# Altium schematic sheet LCD.SchDoc
size A3; SheetNumber: 5; SheetTotal: 6
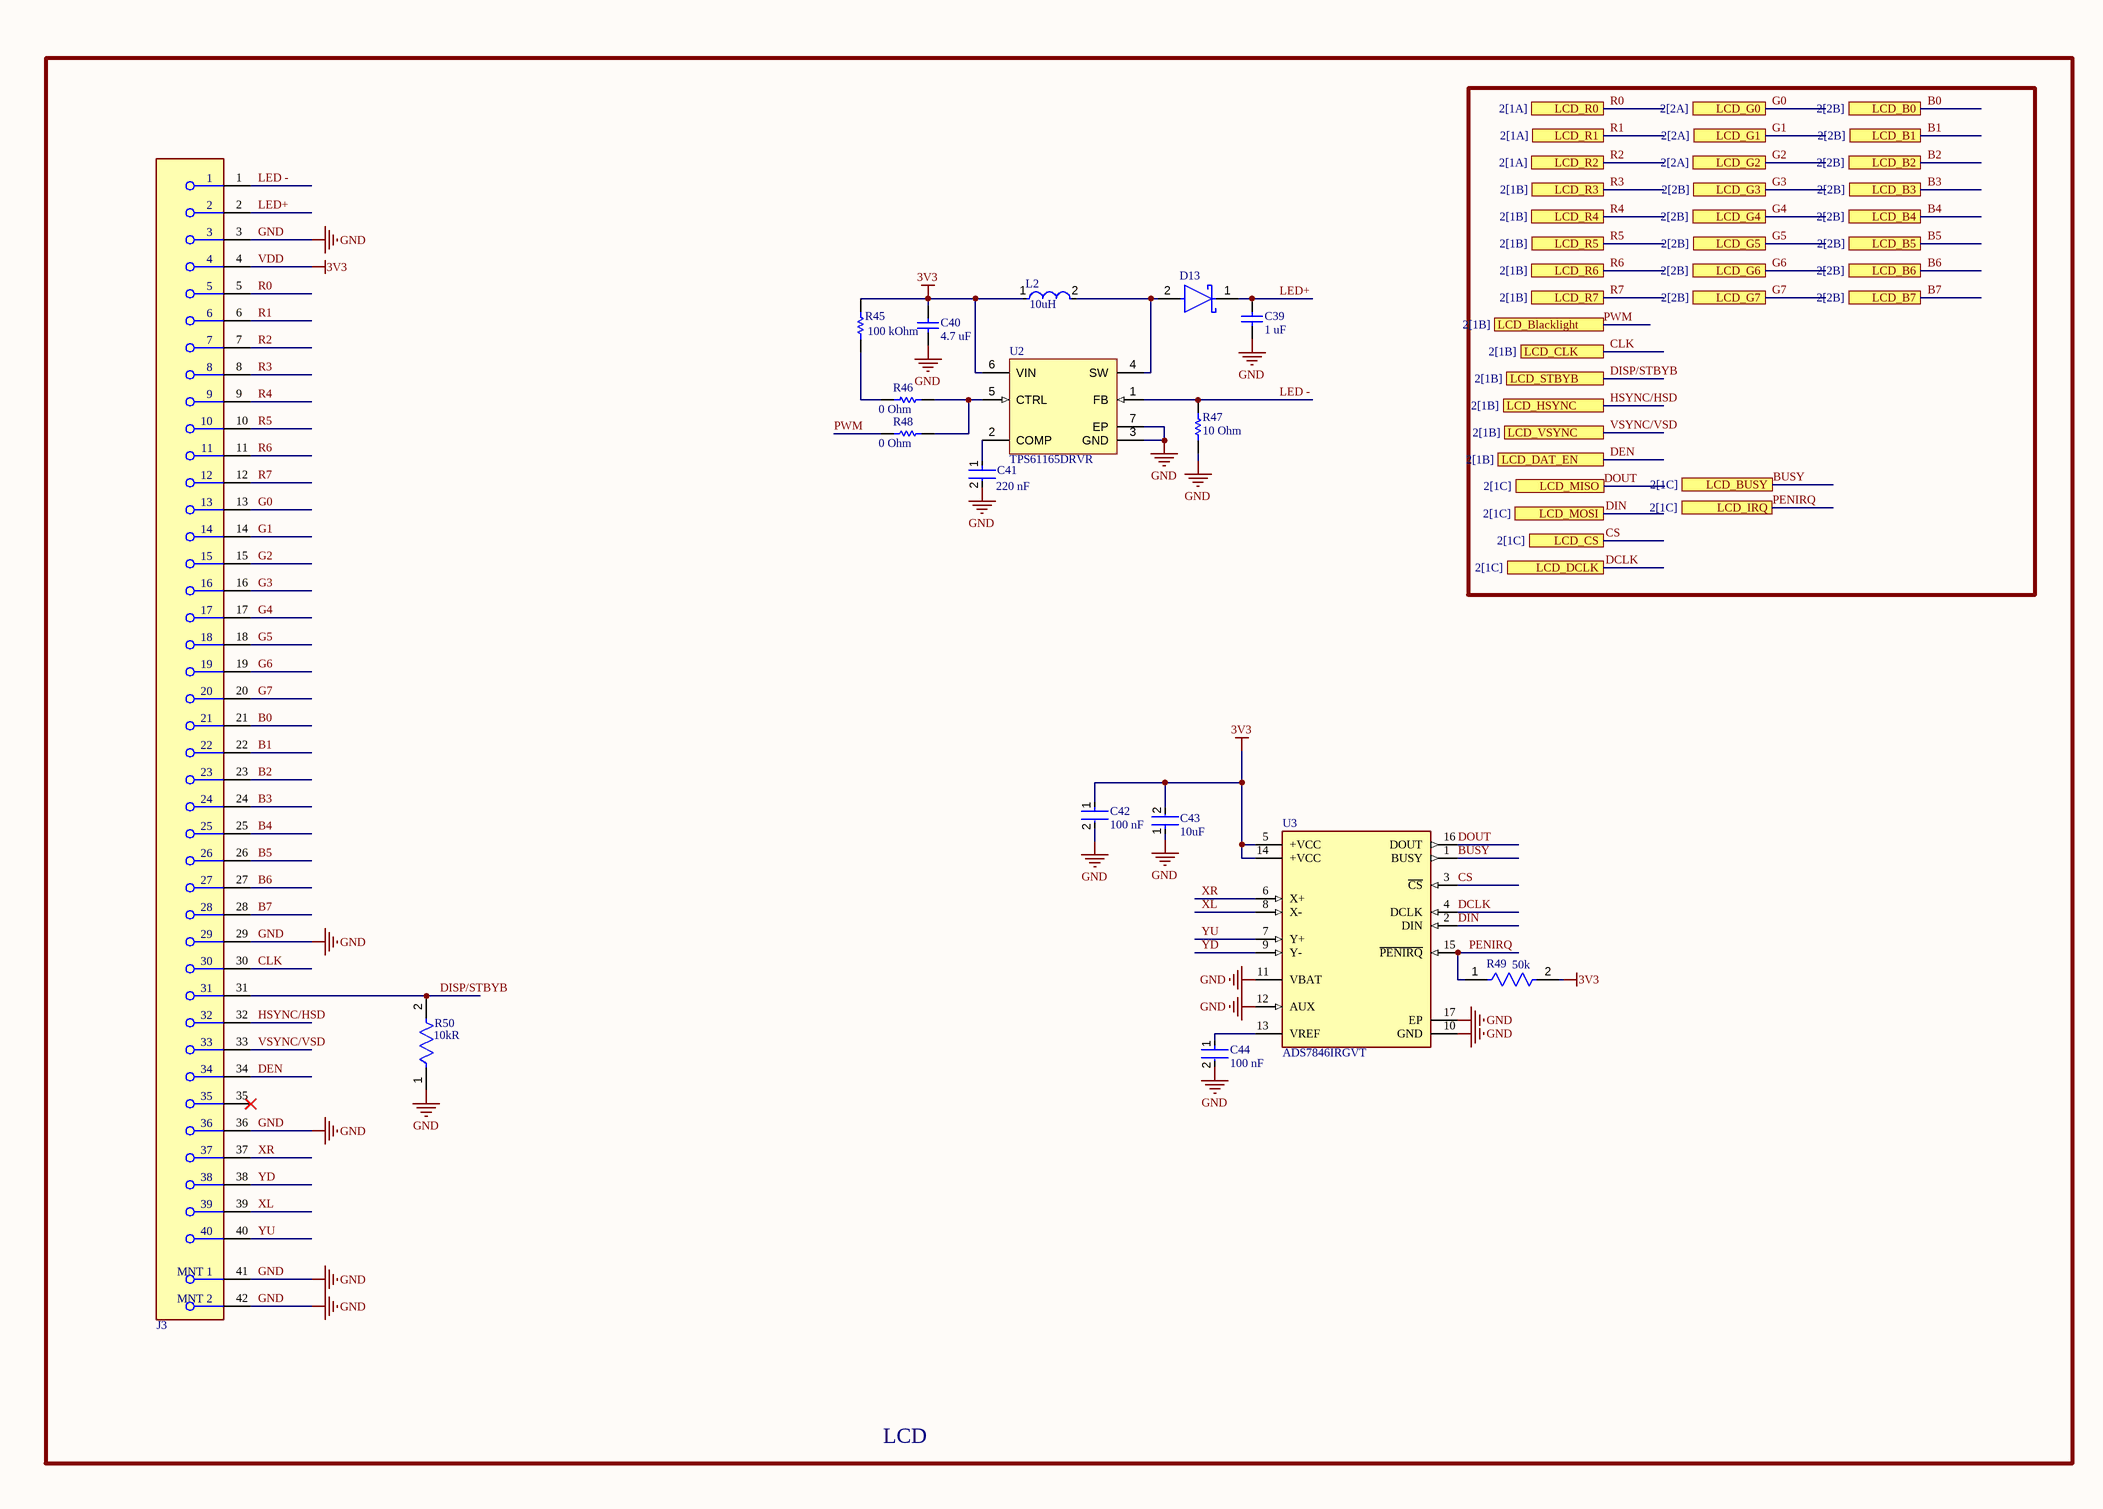
[diagram p0: LCD.SchDoc]

## Parts
C39  value 1 uF  [CAPC2013X135X45LL10T25]  (hidden comment: GRM21BR60J225KA01K)
C40  value 4.7 uF  [CAPC2013X145X50NL20T25]  (hidden comment: C0805C475K9PACTU)
C41  value 220 nF  [FP-CC0805-0_85-MFG]  (hidden comment: CC0805KPX7R7BB224)
C42  value 100 nF  [FP-CC0603-DA-MFG]  (hidden comment: CC0603KRX7R7BB104)
C43  Capacitance: 10uF  [FP-GRM21B-0_15-IPC_A]  (hidden comment: GRM21BR61E106MA73L)
C44  value 100 nF  [FP-CC0603-DA-MFG]  (hidden comment: CC0603KRX7R7BB104)
D13  MBR0540-TP  [FP-SOD-123-MFG]  (value not drawn)
J3  FH12-40S-0.5SH(55)  [FP-FH12-40S-0_5SH_55-MFG]  (value not drawn)
L2  Inductance: 10uH  [FP-NR6012-MFG]  (hidden comment: NR6012T100ME)
R45  value 100 kOhm  [RESC2013X70X40NL20T20]  (hidden comment: ERJ-6GEYJ104V)
R46  value 0 Ohm  [RESC2013X50X30LL20T20]  (hidden comment: CRCW08050000Z0EA)
R47  value 10 Ohm  [RESC2013X50X30NL20T20]  (hidden comment: CRCW080510R0FKEA)
R48  value 0 Ohm  [RESC2013X50X30LL20T20]  (hidden comment: CRCW08050000Z0EA)
R49  value 50k  [FP-RT0603-0_55-MFG]  (hidden comment: RT0603BRD0750KL)
R50  Resistance: 10kR  [FP-MC01W0805-IPC_C]  (hidden comment: MC01W0805110K)
U2  TPS61165DRVR  [DRV0006A_V]
U3  ADS7846IRGVT  [FP-RGV0016B-MFG]

## Ports
LCD_B0 (see 2[2B]), LCD_B1 (see 2[2B]), LCD_B2 (see 2[2B]), LCD_B3 (see 2[2B]), LCD_B4 (see 2[2B]), LCD_B5 (see 2[2B]), LCD_B6 (see 2[2B]), LCD_B7 (see 2[2B]), LCD_Blacklight (see 2[1B]), LCD_BUSY (see 2[1C]), LCD_CLK (see 2[1B]), LCD_CS (see 2[1C]), LCD_DAT_EN (see 2[1B]), LCD_DCLK (see 2[1C]), LCD_G0 (see 2[2A]), LCD_G1 (see 2[2A]), LCD_G2 (see 2[2A]), LCD_G3 (see 2[2B]), LCD_G4 (see 2[2B]), LCD_G5 (see 2[2B]), LCD_G6 (see 2[2B]), LCD_G7 (see 2[2B]), LCD_HSYNC (see 2[1B]), LCD_IRQ (see 2[1C]), LCD_MISO (see 2[1C]), LCD_MOSI (see 2[1C]), LCD_R0 (see 2[1A]), LCD_R1 (see 2[1A]), LCD_R2 (see 2[1A]), LCD_R3 (see 2[1B]), LCD_R4 (see 2[1B]), LCD_R5 (see 2[1B]), LCD_R6 (see 2[1B]), LCD_R7 (see 2[1B]), LCD_STBYB (see 2[1B]), LCD_VSYNC (see 2[1B])

## Nets
GND: C39.1 C40.1 C41.2 C42.2 C43.1 C44.2 J3.3 J3.29 J3.36 J3.41(MNT_1) J3.42(MNT_2) R47.1 R50.1 U2.3(GND) U2.7(EP) U3.10(GND) U3.11(VBAT) U3.12(AUX) U3.17(EP)
VDD: C40.2 C42.1 C43.2 J3.4 L2.1 R45.2 R49.2 U2.6(VIN) U3.5(+VCC) U3.14(+VCC)  [also labelled 3V3]
B0: J3.21 ; port LCD_B0
B1: J3.22 ; port LCD_B1
B2: J3.23 ; port LCD_B2
B3: J3.24 ; port LCD_B3
B4: J3.25 ; port LCD_B4
B5: J3.26 ; port LCD_B5
B6: J3.27 ; port LCD_B6
B7: J3.28 ; port LCD_B7
BUSY: U3.1(BUSY) ; port LCD_BUSY
CLK: J3.30 ; port LCD_CLK
CS: U3.3(~{CS}) ; port LCD_CS
DCLK: U3.4(DCLK) ; port LCD_DCLK
DEN: J3.34 ; port LCD_DAT_EN
DIN: U3.2(DIN) ; port LCD_MOSI
DISP/STBYB: J3.31 R50.2 ; port LCD_STBYB
DOUT: U3.16(DOUT) ; port LCD_MISO
G0: J3.13 ; port LCD_G0
G1: J3.14 ; port LCD_G1
G2: J3.15 ; port LCD_G2
G3: J3.16 ; port LCD_G3
G4: J3.17 ; port LCD_G4
G5: J3.18 ; port LCD_G5
G6: J3.19 ; port LCD_G6
G7: J3.20 ; port LCD_G7
HSYNC/HSD: J3.32 ; port LCD_HSYNC
LED -: J3.1 R47.2 U2.1(FB)
LED+: C39.2 D13.1(C) J3.2
PENIRQ: R49.1 U3.15(~{PENIRQ}) ; port LCD_IRQ
PWM: R48.1 ; port LCD_Blacklight
R0: J3.5 ; port LCD_R0
R1: J3.6 ; port LCD_R1
R2: J3.7 ; port LCD_R2
R3: J3.8 ; port LCD_R3
R4: J3.9 ; port LCD_R4
R5: J3.10 ; port LCD_R5
R6: J3.11 ; port LCD_R6
R7: J3.12 ; port LCD_R7
VSYNC/VSD: J3.33 ; port LCD_VSYNC
XL: J3.39 U3.8(X-)
XR: J3.37 U3.6(X+)
YD: J3.38 U3.9(Y-)
YU: J3.40 U3.7(Y+)
NetC41_1: C41.1 U2.2(COMP)
NetC44_1: C44.1 U3.13(VREF)
NetD13_2: D13.2(A) L2.2 U2.4(SW)
NetR45_1: R45.1 R46.1
NetR46_2: R46.2 R48.2 U2.5(CTRL)

Not connected (* = marked no-connect by the designer): J3 35*

## Notes on the sheet
- LCD
- THIS DOCUMENT AND THE DATA DISCLOSED HEREIN OR
- HEREWITH IS THE PROPERTY OF ALTIUM LIMITED AND MAY
- DWG NO:
- REVISION
- REV:
- DESCRIPTION
- DATE
- APPROVED
- BE FREELY DISTRIBUTED IN WHOLE. NO RIGHTS ARE
- RESERVED OR EXPRESS OR IMPLIED WARANTEE GIVEN.
- ENG:
- APPROVALS
- PROJECT
- DSN:
- CHK:
- REFERENCE DOCUMENTS
- PROJECT REVISION:
- TITLE
- DOCUMENT REVISION:
- DESIGN ITEM:
- BOM:
- FAB DWG:
- PCB DWG:
- ASSY DWG:
- SCALE:
- A3
- SIZE
- CAGE CODE
- FILE NAME
- DWG NO.
- SHEET
- OF
- REV

## Library data of the parts
C39 = CMP-2007-03531-1: Manufacturer: Murata; Part Number: GRM21BR60J225KA01K
C40 = CMP-2007-01009-1: Manufacturer: Kemet; Part Number: C0805C475K9PACTU
C41 = CMP-03422-000357-1: CC0805 220 nF X7R 10.00% 16 V; Manufacturer: Yageo; Tolerance: 0.1; Voltage Rating: 16 V; Material: Ceramic; Lead Free: Yes; Mouser Description: Multilayer Ceramic Capacitors MLCC - SMD/SMT 220nF 16V X7R 10%; Temperature Characteristic: X7R; Package: CC0805-0.85; Footprint Url: http://www.yageo.com/exep/pages/download/literatures/UPY-C_GEN_24.pdf; Temperature Range Low: -30°C; Octopart: https://octopart.com/cc0805kpx7r7bb224-yageo-24924096; Device Class L3: Ceramic Capacitors; ComponentLink2URL: http://www.yageo.com/documents/recent/UPY-GPHC_Y5V_6.3V-to-50V_8.pdf; Device Class L2: Capacitors; Manufacturer Part Number: CC0805KPX7R7BB224; Automotive: No; ComponentLink2Description: Datasheet; Temperature: -30°C to +85°C; Temperature Range High: +85°C; Device Class L1: Passive Components; Capacitance: 220 nF; RoHS: TRUE; Category: Cap; Ipc Land Pattern Name: CAPC200125X85; Height: 0.95mm
C42 C44 = CMP-2000-05002-2: CAP CER 0.1UF 16V X7R 0603; Manufacturer: YAGEO; Tolerance: 0.1; Temperature Coefficient: 15%; Material: Ceramic; Voltage Rating: 16 V; Package: CC0603-DA; ComponentLink2Description: Datasheet; Octopart: https://octopart.com/cc0603krx7r7bb104-yageo-192941; Temperature Range High: +125°C; Digikey Description: CAP CER 0.1UF 16V X7R 0603; Voltage: 16 V; Device Class L2: Capacitors; Height: 0.9mm; Temperature: -55°C to +125°C; Manufacturer Part Number: CC0603KRX7R7BB104; Device Class L1: Passive Components; Device Class L3: Ceramic Capacitors; ComponentLink2URL: http://www.yageo.com/documents/recent/UPY-GPHC_X7R_6.3V-to-50V_18.pdf; Footprint Url: http://www.yageo.com/exep/pages/download/literatures/UPY-C_GEN_24.pdf; RoHS: TRUE; Temperature Range Low: -55°C; Temperature Characteristic: X7R; Lead Free: Yes; Capacitance: 100 nF; Category: Cap; Mouser Description: Multilayer Ceramic Capacitor, CC Series, 0.1 - F, - 10%, X7R, 16 V, 0603 [1608 Metric]; Automotive: No
C43 = CMP-06035-013048-1: Chip Multilayer Ceramic Capacitors for General Purpose, 0805, 10uF, X5R, 15%, 20%, 25V; Max Operating Temperature: 85°C; Package Quantity: 3000; Case/Package: 0805; Depth: 1.25mm; Case Code (Imperial): 0805; Termination: SMD/SMT; Width: 0.049inch; Packaging: Tape and Reel; Tolerance: 20%; Height: 1.25mm; Min Operating Temperature: -55°C; Weight: 0.000335oz; Voltage Rating (DC): 25V; Dielectric: X5R; Length: 2mm; Thickness: 0.055inch; Voltage Rating: 25V; Resistor Type: Ceramic; Lead Free: Lead Free; Case Code (Metric): 2012; Mount: Surface Mount; REACH SVHC: No SVHC
D13 = CMP-2000-06672-2: DIODE SCHOTTKY 40V 500MA SOD123; Polarity: Standard; Peak Non-Repetitive Surge Current: 5.5A; Forward Voltage: 550mV; Peak Reverse Current: 200uA; Element Configuration: Single; Capacitance: 30pF; Max Reverse Voltage (DC): 40V; Package Quantity: 1; Packaging: Tape and Reel; Min Operating Temperature: -55°C; Forward Current: 500mA; Average Rectified Current: 500mA; Max Operating Temperature: 150°C; Current Rating: 500mA; Max Forward Surge Current (Ifsm): 5.5A; Radiation Hardening: No; Output Current: 500mA; Lead Free: Lead Free; Mount: Surface Mount; Max Repetitive Reverse Voltage (Vrrm): 40V; Number of Pins: 2; Voltage Rating (DC): 40V
J3 = CMP-2000-06267-2: CONN FFC BOTTOM 40POS 0.50MM R/A; Current Rating: 500mA; Voltage Rating: 50V; Contact Resistance: 50mR; Gender: Female; Pitch: 0.5mm; Max Current Rating: 400mA; Actuator Material: Polyphenylene; Wire/Cable Type: Straight; Mating Cycles: 20; Insulation Resistance: 500MR; Number of Contacts: 40; Contact Material: Bronze; RoHS Compliant: Yes; Housing Color: Beige; Mount: Surface Mount; Number of Rows: 1; Contact Location: Bottom; Lead Free: Lead Free; Package Quantity: 2000; Orientation: Right Angle; Insulation Material: Nylon; Flammability Rating: UL94 V-0; Max Operating Temperature: 70°C; Color: Beige; Length: 24.1mm; Lead Pitch: 0.5mm; Width: 24.1mm; Packaging: Tape and Reel; Depth: 5.6mm; Voltage Rating (AC): 50V; REACH SVHC: No SVHC; Contact Plating: Gold; Series: FH12; Min Operating Temperature: -40°C; Housing Material: Polyamide; Termination: Solder; Number of Positions: 40; Max Voltage Rating (AC): 50V
L2 = CMP-14484-001515-1: SMD Power Inductors 10uH ±20% 1A 0.282Ω; Shielding: Shielded; Self Resonant Frequency: 22MHz; Test Frequency: 100kHz; Core Material: Ferrite; DC Resistance (DCR): 282mR; Min Operating Temperature: -25°C; Height: 1.2mm; Halogen Free: Halogen Free; Tolerance: 20%; Mount: Surface Mount; Max DC Current: 1A; Packaging: Cut Tape; RoHS Compliant: Yes; Max Operating Temperature: 120°C; Current Rating: 1A; Termination: SMD/SMT; Inductance Tolerance: 20%; Width: 6mm; Length: 0.236inch; Series: NR; Case/Package: 2424; Saturation Current: 1A; RMS Current (Irms): 1A; Package Quantity: 1000
R45 = CMP-2001-00338-1: Manufacturer: Panasonic; Part Number: ERJ-6GEYJ104V
R46 R48 = CMP-2001-04896-1: Manufacturer: Vishay Dale; Part Number: CRCW08050000Z0EA
R47 = CMP-2001-04915-1: Manufacturer: Vishay Dale; Part Number: CRCW080510R0FKEA
R49 = CMP-03412-048226-1: RES 50K OHM 0.1% 1/10W 0603
R50 = CMP-12256-000003-1: Resistor, 10K, 0.1W, 1%, 0805, Reel; Voltage Rating: 150V; Temperature Coefficient: 100ppm/°C; Power Rating: 100mW; REACH SVHC: No SVHC; Composition: Thick Film; Max Operating Temperature: 155°C; Case/Package: 0805; Tolerance: 1%; Number of Pins: 2; Case Code (Metric): 2012; Voltage Rating (DC): 150V; Min Operating Temperature: -55°C; Width: 1.25mm; Case Code (Imperial): 0805; Packaging: Cut Tape
U2 = CMP-0388-00237-2: High Brightness White LED Driver, 3 to 18 V, -40 to 85 degC, 6-pin SON (DRV6), Green (RoHS & no Sb/Br); Manufacturer: Texas Instruments; Dimming: TRUE; Topology: Boost; Rating: Catalog; Iq(Typ)(mA): 1.5; Switching Frequency(Max)(kHz): 1200; Vin(Max)(V): 18; Vin(Min)(V): 3; PackageReference: DRV0006A; PackageVersion: 4206925/E; PartNumber: TPS61165DRVR; ComponentLink3Description: Package Specification; ComponentLink2Description: Datasheet; Eco-Plan: Green (RoHS & no Sb/Br); DatasheetVersion: SLVS790B; ComponentLink1URL: http://www.ti.com/; ComponentLink2URL: http://www.ti.com/general/docs/lit/getliterature.tsp?genericPartNumber=TPS61165&fileType=pdf; PackageDescription: 6-Pin Plastic Small Outline No-Lead, Body 2 x 2 mm, Pitch 0.65 mm; ComponentLink1Description: Manufacturer URL; Mounting Technology: Surface Mount; ComponentLink3URL: http://www.ti.com/litv/pdf/mpds216d; Synchronous Rectification: TRUE; SubFamily: White LED Driver
U3 = CMP-04863-000002-1: IC SCREEN CNTRL 12BIT 16FN; Resolution: 12b; Touchscreen: Resistive; Interface: SPI; Max Supply Voltage: 5.25V; Conversion Rate: 125KS/s; Min Supply Voltage: 2.2V; Operating Supply Current: 500uA; Number of Channels: 6; Number of Bits: 12; Weight: 0.001464oz; REACH SVHC: No SVHC; Case/Package: VQFN; Min Operating Temperature: -40°C; Lead Free: Lead Free; Contact Plating: Gold; Length: 4mm; RoHS Compliant: Yes; Sampling Rate: 125KS/s; Mount: Surface Mount; Number of Pins: 16; Height: 0.9mm; Width: 4mm; Radiation Hardening: No; Packaging: Tape and Reel; Max Operating Temperature: 85°C; Package Quantity: 1